# EAGLE design MBHP_CORE_STM32F4v1.1.2 (EAGLE 6.5.0)
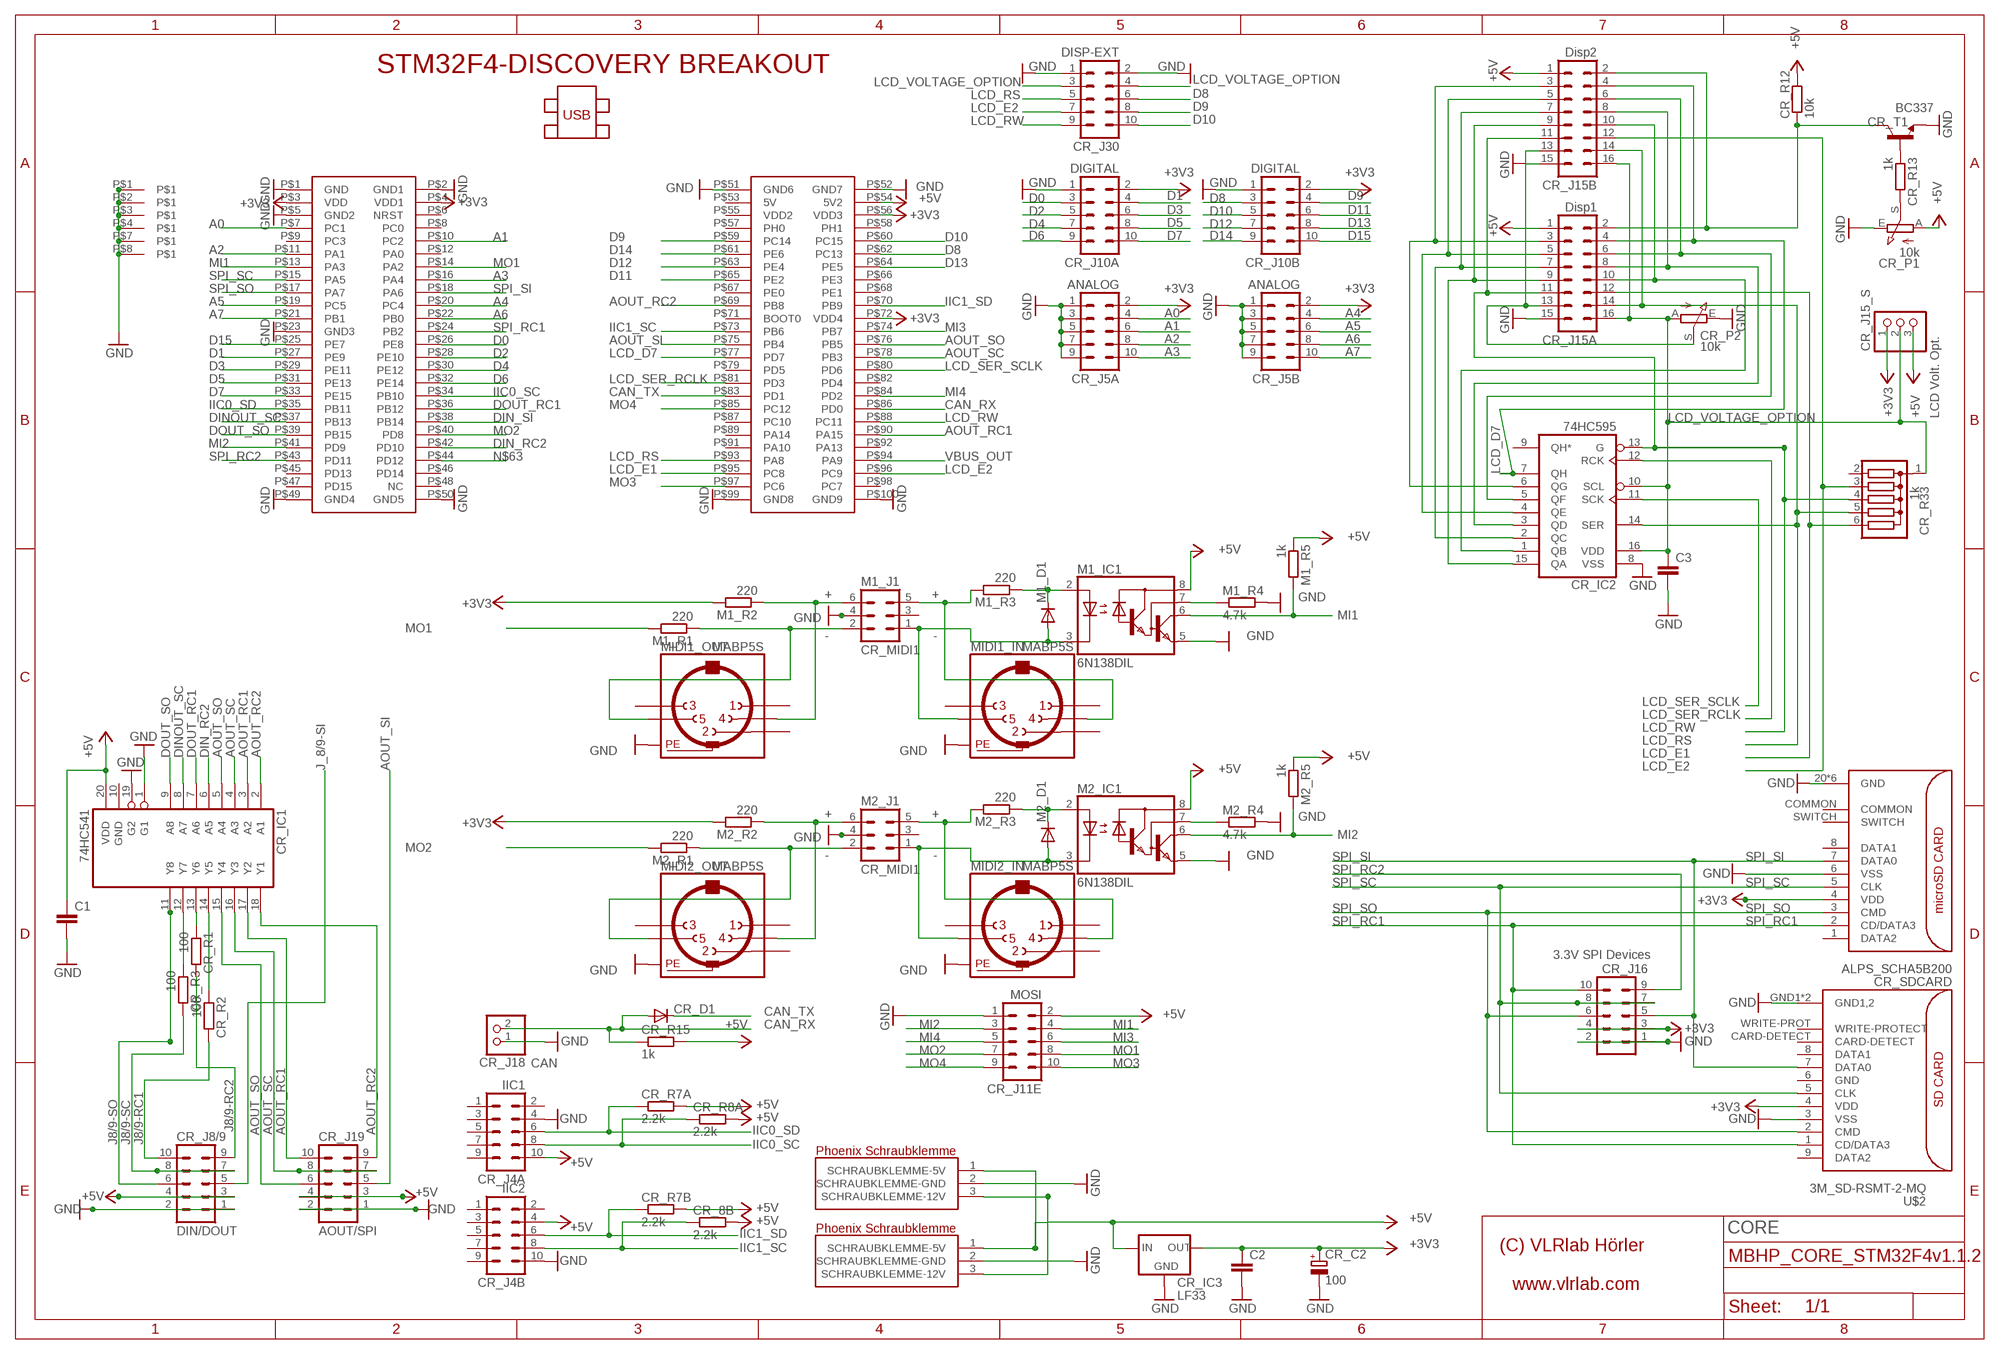
[diagram p0: schematic, sheet 1]

## Parts
C1  C-EU025-025X050  [C025-025X050]
C2  C-EU025-025X050  [C025-025X050]
C3  C-EU025-025X050  [C025-025X050]
CR_8B  2.2k  R-EU_0204/7  [0204/7]
CR_C2  100  CPOL-EUE5-10.5  [E5-10,5]
CR_D1  1N4148  1N4148DO35-7  [DO35-7]
CR_IC1  74HC541  [DIL20]
CR_IC2  74HC595  [DIL16]
CR_IC3  LF33  [TO220]
CR_J4A  IIC1  ML10  [ML10]
CR_J4B  IIC2  ML10  [ML10]
CR_J5A  ANALOG  ML10  [ML10]
CR_J5B  ANALOG  ML10  [ML10]
CR_J8/9  DIN/DOUT  ML10  [ML10]
CR_J10A  DIGITAL  ML10  [ML10]
CR_J10B  DIGITAL  ML10  [ML10]
CR_J11E  MOSI  ML10  [ML10]
CR_J15_S  LCD Volt. Opt.  PINHD-1X3  [1X03]
CR_J15A  Disp1  ML16  [ML16]
CR_J15B  Disp2  ML16  [ML16]
CR_J16  3.3V SPI Devices  ML10  [ML10]
CR_J18  CAN  PINHD-1X2  [1X02]
CR_J19  AOUT/SPI  ML10  [ML10]
CR_J30  DISP-EXT  ML10  [ML10]
CR_P1  10k  PHIER_6MM  [6MM_V]
CR_P2  10k  PHIER_6MM  [6MM_V]
CR_R1  100  R-EU_0204/7  [0204/7]
CR_R2  100  R-EU_0204/7  [0204/7]
CR_R3  100  R-EU_0204/7  [0204/7]
CR_R7A  2.2k  R-EU_0204/7  [0204/7]
CR_R7B  2.2k  R-EU_0204/7  [0204/7]
CR_R8A  2.2k  R-EU_0204/7  [0204/7]
CR_R12  10k  R-EU_0204/7  [0204/7]
CR_R13  1k  R-EU_0204/7  [0204/7]
CR_R15  1k  R-EU_0204/7  [0204/7]
CR_R33  1k  4306R  [SIL6]
CR_SDCARD  ALPS_SCHA5B200  [ALPS_SCHA5B0200_MICRO_SD_PUSHPUSH]
CR_T1  BC337  [TO92]
KLEMME3  PT-1.5/3  [PT-1.5/3-5.0]
KLEMME4  PT-1.5/3  [PT-1.5/3-5.0]
M1_D1  1N4148DO35-7  [DO35-7]
M1_IC1  6N138DIL  [DIL08]
M1_J1  CR_MIDI1  ML6  [ML6]
M1_R1  220  R-EU_0204/7  [0204/7]
M1_R2  220  R-EU_0204/7  [0204/7]
M1_R3  220  R-EU_0204/7  [0204/7]
M1_R4  4.7k  R-EU_0204/7  [0204/7]
M1_R5  1k  R-EU_0204/7  [0204/7]
M2_D1  1N4148DO35-7  [DO35-7]
M2_IC1  6N138DIL  [DIL08]
M2_J1  CR_MIDI1  ML6  [ML6]
M2_R1  220  R-EU_0204/7  [0204/7]
M2_R2  220  R-EU_0204/7  [0204/7]
M2_R3  220  R-EU_0204/7  [0204/7]
M2_R4  4.7k  R-EU_0204/7  [0204/7]
M2_R5  1k  R-EU_0204/7  [0204/7]
MIDI1_IN  MABP5S  [MABP5S]
MIDI1_OUT  MABP5S  [MABP5S]
MIDI2_IN  MABP5S  [MABP5S]
MIDI2_OUT  MABP5S  [MABP5S]
OUTLINE  MIDIBOX_FULL  [MIDIBOX14X12]
STM32F4DISCOVERY  STM32F4-DISCOVERY  [STM32F4-DISCOVERY]
U$2  3M_SD-RSMT-2-MQ  [3M_SD-RSMT-2-MQ]

## Nets
+3V3 [SDcard]: C2.1 CR_C2.+ CR_IC3.OUT CR_J5A.2 CR_J5B.2 CR_J10A.2 CR_J10B.2 CR_J15_S.1 CR_J16.3 CR_J16.4 CR_SDCARD.4(VDD) M1_R2.2 M2_R2.2 STM32F4DISCOVERY.P$3(VDD) STM32F4DISCOVERY.P$4(VDD1) STM32F4DISCOVERY.P$56(VDD3) STM32F4DISCOVERY.P$72(VDD4) U$2.4(VDD)
+5V [VDD]: C1.1 CR_8B.2 CR_IC1.20(VDD) CR_IC3.IN CR_J4A.10 CR_J4B.4 CR_J8/9.3 CR_J8/9.4 CR_J11E.2 CR_J15_S.3 CR_J15A.1 CR_J15B.1 CR_J19.3 CR_J19.4 CR_P1.A CR_R7A.2 CR_R7B.2 CR_R8A.2 CR_R12.2 CR_R15.2 KLEMME3.1(SCHRAUBKLEMME-5V) KLEMME4.1(SCHRAUBKLEMME-5V) M1_IC1.8(VCC) M1_R5.1 M2_IC1.8(VCC) M2_R5.1 STM32F4DISCOVERY.P$54(5V2)
+12V1 [10V]: KLEMME3.3(SCHRAUBKLEMME-12V) KLEMME4.3(SCHRAUBKLEMME-12V)
A0: CR_J5A.4 STM32F4DISCOVERY.P$7(PC1)
A1: CR_J5A.6 STM32F4DISCOVERY.P$10(PC2)
A2: CR_J5A.8 STM32F4DISCOVERY.P$11(PA1)
A3: CR_J5A.10 STM32F4DISCOVERY.P$16(PA4)
A4: CR_J5B.4 STM32F4DISCOVERY.P$20(PC4)
A5: CR_J5B.6 STM32F4DISCOVERY.P$19(PC5)
A6: CR_J5B.8 STM32F4DISCOVERY.P$22(PB0)
A7: CR_J5B.10 STM32F4DISCOVERY.P$21(PB1)
AOUT_RC1: CR_IC1.3(A2) CR_IC1.17(Y2) CR_J19.10 STM32F4DISCOVERY.P$90(PA15)
AOUT_RC2: CR_IC1.2(A1) CR_IC1.18(Y1) CR_J19.9 STM32F4DISCOVERY.P$69(PB8)
AOUT_SC: CR_IC1.4(A3) CR_IC1.16(Y3) CR_J19.7 CR_J19.8 STM32F4DISCOVERY.P$78(PB3)
AOUT_SI: CR_J19.5 STM32F4DISCOVERY.P$75(PB4)
AOUT_SO: CR_IC1.5(A4) CR_IC1.15(Y4) CR_J19.6 STM32F4DISCOVERY.P$76(PB5)
CAN_RX: CR_D1.A CR_J18.2 CR_R15.1 STM32F4DISCOVERY.P$86(PD0)
CAN_TX: CR_D1.C STM32F4DISCOVERY.P$83(PD1)
D0: CR_J10A.3 STM32F4DISCOVERY.P$26(PE8)
D1: CR_J10A.4 STM32F4DISCOVERY.P$27(PE9)
D2: CR_J10A.5 STM32F4DISCOVERY.P$28(PE10)
D3: CR_J10A.6 STM32F4DISCOVERY.P$29(PE11)
D4: CR_J10A.7 STM32F4DISCOVERY.P$30(PE12)
D5: CR_J10A.8 STM32F4DISCOVERY.P$31(PE13)
D6: CR_J10A.9 STM32F4DISCOVERY.P$32(PE14)
D7: CR_J10A.10 STM32F4DISCOVERY.P$33(PE15)
D8: CR_J10B.3 CR_J30.6 STM32F4DISCOVERY.P$62(PC13)
D9: CR_J10B.4 CR_J30.8 STM32F4DISCOVERY.P$59(PC14)
D10: CR_J10B.5 CR_J30.10 STM32F4DISCOVERY.P$60(PC15)
D11: CR_J10B.6 STM32F4DISCOVERY.P$65(PE2)
D12: CR_J10B.7 STM32F4DISCOVERY.P$63(PE4)
D13: CR_J10B.8 STM32F4DISCOVERY.P$64(PE5)
D14: CR_J10B.9 STM32F4DISCOVERY.P$61(PE6)
D15: CR_J10B.10 STM32F4DISCOVERY.P$25(PE7)
DIN_RC2: CR_IC1.6(A5) STM32F4DISCOVERY.P$42(PD10)
DIN_SI: STM32F4DISCOVERY.P$38(PB14)
DINOUT_SC: CR_IC1.8(A7) STM32F4DISCOVERY.P$37(PB13)
DOUT_RC1: CR_IC1.7(A6) STM32F4DISCOVERY.P$36(PB12)
DOUT_SO: CR_IC1.9(A8) STM32F4DISCOVERY.P$39(PB15)
GND: C1.2 C2.2 C3.2 CR_C2.- CR_IC1.1(G1) CR_IC1.19(G2) CR_IC2.8(VSS) CR_IC3.GND CR_J4A.4 CR_J4B.10 CR_J5A.1 CR_J5A.3 CR_J5A.5 CR_J5A.7 CR_J5A.9 CR_J5B.1 CR_J5B.3 CR_J5B.5 CR_J5B.7 CR_J5B.9 CR_J8/9.1 CR_J8/9.2 CR_J10A.1 CR_J10B.1 CR_J11E.1 CR_J15A.15 CR_J15B.15 CR_J16.1 CR_J16.2 CR_J18.1 CR_J19.1 CR_J19.2 CR_J30.1 CR_J30.2 CR_P1.E CR_P2.E CR_SDCARD.6(VSS) CR_SDCARD.20(GND) CR_SDCARD.21(GND) CR_SDCARD.22(GND) CR_SDCARD.23(GND) CR_SDCARD.24(GND) CR_SDCARD.25(GND) CR_T1.1(E) KLEMME3.2(SCHRAUBKLEMME-GND) KLEMME4.2(SCHRAUBKLEMME-GND) M1_IC1.5(GND) M1_J1.4 M1_R4.2 M2_IC1.5(GND) M2_J1.4 M2_R4.2 MIDI1_IN.PE MIDI1_IN.PE@(PE) MIDI1_OUT.PE MIDI1_OUT.PE@(PE) MIDI2_IN.PE MIDI2_IN.PE@(PE) MIDI2_OUT.PE MIDI2_OUT.PE@(PE) OUTLINE.P$1 OUTLINE.P$2 OUTLINE.P$3 OUTLINE.P$4 OUTLINE.P$7 OUTLINE.P$8 STM32F4DISCOVERY.P$1(GND) STM32F4DISCOVERY.P$2(GND1) STM32F4DISCOVERY.P$5(GND2) STM32F4DISCOVERY.P$23(GND3) STM32F4DISCOVERY.P$49(GND4) STM32F4DISCOVERY.P$50(GND5) STM32F4DISCOVERY.P$51(GND6) STM32F4DISCOVERY.P$52(GND7) STM32F4DISCOVERY.P$99(GND8) STM32F4DISCOVERY.P$100(GND9) U$2.3(VSS) U$2.GND1(GND1,2) U$2.GND2(GND1,2)
IIC0_SC: CR_J4A.8 CR_R8A.1 STM32F4DISCOVERY.P$34(PB10)
IIC0_SD: CR_J4A.6 CR_R7A.1 STM32F4DISCOVERY.P$35(PB11)
IIC1_SC: CR_8B.1 CR_J4B.8 STM32F4DISCOVERY.P$73(PB6)
IIC1_SD: CR_J4B.6 CR_R7B.1 STM32F4DISCOVERY.P$70(PB9)
J8/9-RC1: CR_J8/9.10 CR_R2.2
J8/9-RC2: CR_J8/9.9 CR_R1.2
J8/9-SC: CR_J8/9.7 CR_J8/9.8 CR_R3.2
J8/9-SO: CR_IC1.11(Y8) CR_J8/9.6
J_8/9-SI: CR_J8/9.5
LCD_D7: CR_IC2.7(QH) CR_J15A.4 CR_J15B.4 STM32F4DISCOVERY.P$77(PD7)
LCD_E1: CR_J15A.12 CR_R33.6 STM32F4DISCOVERY.P$95(PC8)
LCD_E2: CR_J15B.12 CR_J30.7 CR_R33.3 STM32F4DISCOVERY.P$96(PC9)
LCD_RS: CR_IC2.14(SER) CR_J15A.14 CR_J15B.14 CR_J30.5 CR_R33.5 STM32F4DISCOVERY.P$93(PA8)
LCD_RW: CR_IC2.13(G) CR_J15A.11 CR_J15B.11 CR_J30.9 CR_R33.4 STM32F4DISCOVERY.P$88(PC11)
LCD_SER_RCLK: CR_IC2.12(RCK) STM32F4DISCOVERY.P$81(PD3)
LCD_SER_SCLK: CR_IC2.11(SCK) STM32F4DISCOVERY.P$80(PD6)
LCD_VOLTAGE_OPTION [VDD]: C3.1 CR_IC2.10(SCL) CR_IC2.16(VDD) CR_J15_S.2 CR_J15A.16 CR_J15B.16 CR_J30.3 CR_J30.4 CR_P2.A CR_R33.1
M1_R4: M1_IC1.7(VB) M1_R4.1
M1_RX+: M1_J1.5 M1_R3.2 MIDI1_IN.4
M1_RX+D1: M1_D1.C M1_IC1.2(A) M1_R3.1
M1_RX-: M1_D1.A M1_IC1.3(C) M1_J1.1 MIDI1_IN.5
M1_TX+: M1_J1.6 M1_R2.1 MIDI1_OUT.4
M1_TX-: M1_J1.2 M1_R1.1 MIDI1_OUT.5
M2_R4: M2_IC1.7(VB) M2_R4.1
M2_RX+: M2_J1.5 M2_R3.2 MIDI2_IN.4
M2_RX+D1: M2_D1.C M2_IC1.2(A) M2_R3.1
M2_RX-: M2_D1.A M2_IC1.3(C) M2_J1.1 MIDI2_IN.5
M2_TX+: M2_J1.6 M2_R2.1 MIDI2_OUT.4
M2_TX-: M2_J1.2 M2_R1.1 MIDI2_OUT.5
MI1: CR_J11E.4 M1_IC1.6(VO) M1_R5.2 STM32F4DISCOVERY.P$13(PA3)
MI2: CR_J11E.3 M2_IC1.6(VO) M2_R5.2 STM32F4DISCOVERY.P$41(PD9)
MI3: CR_J11E.6 STM32F4DISCOVERY.P$74(PB7)
MI4: CR_J11E.5 STM32F4DISCOVERY.P$84(PD2)
MO1: CR_J11E.8 M1_R1.2 STM32F4DISCOVERY.P$14(PA2)
MO2: CR_J11E.7 M2_R1.2 STM32F4DISCOVERY.P$40(PD8)
MO3: CR_J11E.10 STM32F4DISCOVERY.P$97(PC6)
MO4: CR_J11E.9 STM32F4DISCOVERY.P$85(PC12)
N$1: CR_IC2.6(QG) CR_J15A.3 CR_J15B.3
N$2: CR_IC2.5(QF) CR_J15A.6 CR_J15B.6
N$3: CR_IC2.4(QE) CR_J15A.5 CR_J15B.5
N$4: CR_IC2.3(QD) CR_J15A.8 CR_J15B.8
N$8: CR_IC2.2(QC) CR_J15A.7 CR_J15B.7
N$9: CR_IC2.1(QB) CR_J15A.10 CR_J15B.10
N$10: CR_IC2.15(QA) CR_J15A.9 CR_J15B.9
N$12: CR_J15A.13 CR_J15B.13 CR_P2.S
N$14: CR_P1.S CR_R13.2
N$15: CR_R13.1 CR_T1.2(B)
N$16: M2_J1.3
N$18: CR_J15A.2 CR_J15B.2 CR_R12.1 CR_T1.3(C)
N$24: M1_J1.3
N$63: STM32F4DISCOVERY.P$44(PD12)
RC-I-: CR_IC1.14(Y5) CR_R2.1
RC-O-: CR_IC1.13(Y6) CR_R1.1
SC-: CR_IC1.12(Y7) CR_R3.1
SPI_RC1: CR_J16.10 CR_SDCARD.2(CD/DATA3) STM32F4DISCOVERY.P$24(PB2) U$2.1(CD/DATA3)
SPI_RC2: CR_J16.9 STM32F4DISCOVERY.P$43(PD11)
SPI_SC: CR_J16.7 CR_J16.8 CR_SDCARD.5(CLK) STM32F4DISCOVERY.P$15(PA5) U$2.5(CLK)
SPI_SI: CR_J16.5 CR_SDCARD.7(DATA0) STM32F4DISCOVERY.P$18(PA6) U$2.7(DATA0)
SPI_SO: CR_J16.6 CR_SDCARD.3(CMD) STM32F4DISCOVERY.P$17(PA7) U$2.2(CMD)
VBUS_OUT: STM32F4DISCOVERY.P$94(PA9)
Unconnected: CR_IC2.9(QH*) CR_J4A.1 CR_J4A.2 CR_J4A.3 CR_J4A.5 CR_J4A.7 CR_J4A.9 CR_J4B.1 CR_J4B.2 CR_J4B.3 CR_J4B.5 CR_J4B.7 CR_J4B.9 CR_R33.2 CR_SDCARD.1(DATA2) CR_SDCARD.8(DATA1) CR_SDCARD.COMMON CR_SDCARD.SWITCH MIDI1_IN.1 MIDI1_IN.2 MIDI1_IN.3 MIDI1_OUT.1 MIDI1_OUT.2 MIDI1_OUT.3 MIDI2_IN.1 MIDI2_IN.2 MIDI2_IN.3 MIDI2_OUT.1 MIDI2_OUT.2 MIDI2_OUT.3 STM32F4DISCOVERY.P$6(NRST) STM32F4DISCOVERY.P$8(PC0) STM32F4DISCOVERY.P$9(PC3) STM32F4DISCOVERY.P$12(PA0) STM32F4DISCOVERY.P$45(PD13) STM32F4DISCOVERY.P$46(PD14) STM32F4DISCOVERY.P$47(PD15) STM32F4DISCOVERY.P$48(NC) STM32F4DISCOVERY.P$53(5V) STM32F4DISCOVERY.P$55(VDD2) STM32F4DISCOVERY.P$57(PH0) STM32F4DISCOVERY.P$58(PH1) STM32F4DISCOVERY.P$66(PE3) STM32F4DISCOVERY.P$67(PE0) STM32F4DISCOVERY.P$68(PE1) STM32F4DISCOVERY.P$71(BOOT0) STM32F4DISCOVERY.P$79(PD5) STM32F4DISCOVERY.P$82(PD4) STM32F4DISCOVERY.P$87(PC10) STM32F4DISCOVERY.P$89(PA14) STM32F4DISCOVERY.P$91(PA10) STM32F4DISCOVERY.P$92(PA13) STM32F4DISCOVERY.P$98(PC7) U$2.6(GND) U$2.8(DATA1) U$2.9(DATA2) U$2.CARD-DETECT U$2.WRITE-PROT(WRITE-PROTECT)

## Notes on the sheet
- + | +
- - | -
- + | +
- - | -
- CORE

## Power pins joined to a net without a drawn wire
GND: CR_IC1.10(GND)

## Library data of the parts
C1-C3 = rcl:C-EU: CAPACITOR, European symbol
CR_8B CR_R1-CR_R3 CR_R7A CR_R7B CR_R8A = rcl:R-EU_: RESISTOR, European symbol
CR_C2 = rcl:CPOL-EU: POLARIZED CAPACITOR, European symbol
CR_D1 M1_D1 M2_D1 = diode:1N4148: DIODE high speed (Philips)
CR_IC1 = 595-541-165-uln2803:74HC541
CR_IC2 = 74-595:74HC595
CR_IC3 = LF33:LF33
CR_J4A CR_J4B CR_J5A CR_J5B CR_J8/9 CR_J10A CR_J10B CR_J11E CR_J16 CR_J19 CR_J30 = con-harting-ml:ML10: HARTING; OC_FARNELL: unknown; OC_NEWARK: unknown
CR_J15_S = pinhead_Ivan:PINHD-1X3: PIN HEADER
CR_J15A CR_J15B = con-ml:ML16: HARTING; OC_FARNELL: unknown; OC_NEWARK: unknown
CR_J18 = pinhead_Ivan:PINHD-1X2: PIN HEADER
CR_P1 CR_P2 = Potentiometer 6mm:PHIER_6MM
CR_R12 CR_R13 CR_R15 M1_R1-M1_R5 M2_R1-M2_R5 = resistor:R-EU_: RESISTOR, European symbol
CR_R33 = Bourns Resistor Array:4306R
CR_SDCARD = Micro SD:ALPS_SCHA5B200
CR_T1 = transistor:BC337: NPN TRANSISTOR
KLEMME3 KLEMME4 = Phonenix Contacts:PT-1.5/3
M1_IC1 M2_IC1 = 6N138:6N138DIL
M1_J1 M2_J1 = con-harting-ml:ML6: HARTING; OC_FARNELL: unknown; OC_NEWARK: unknown
MIDI1_IN MIDI1_OUT MIDI2_IN MIDI2_OUT = midi:MABP5S
OUTLINE = Frames_VLR:MIDIBOX_FULL
STM32F4DISCOVERY = STM32F4-DISCOVERY:STM32F4-DISCOVERY
U$2 = Memory:3M_SD-RSMT-2-MQ

## Net classes
0 default: width 0.254 mm, drill 0.33 mm, clearance 0.254 mm
1 VDD: width 1.016 mm, drill 0.33 mm, clearance 0.254 mm to class 0, clearance 0.254 mm
2 10V: width 1.016 mm, drill 0.33 mm, clearance 0.254 mm to class 0, clearance 0.254 mm to class 1, clearance 0.254 mm
3 SDcard: width 0.406 mm

## Board
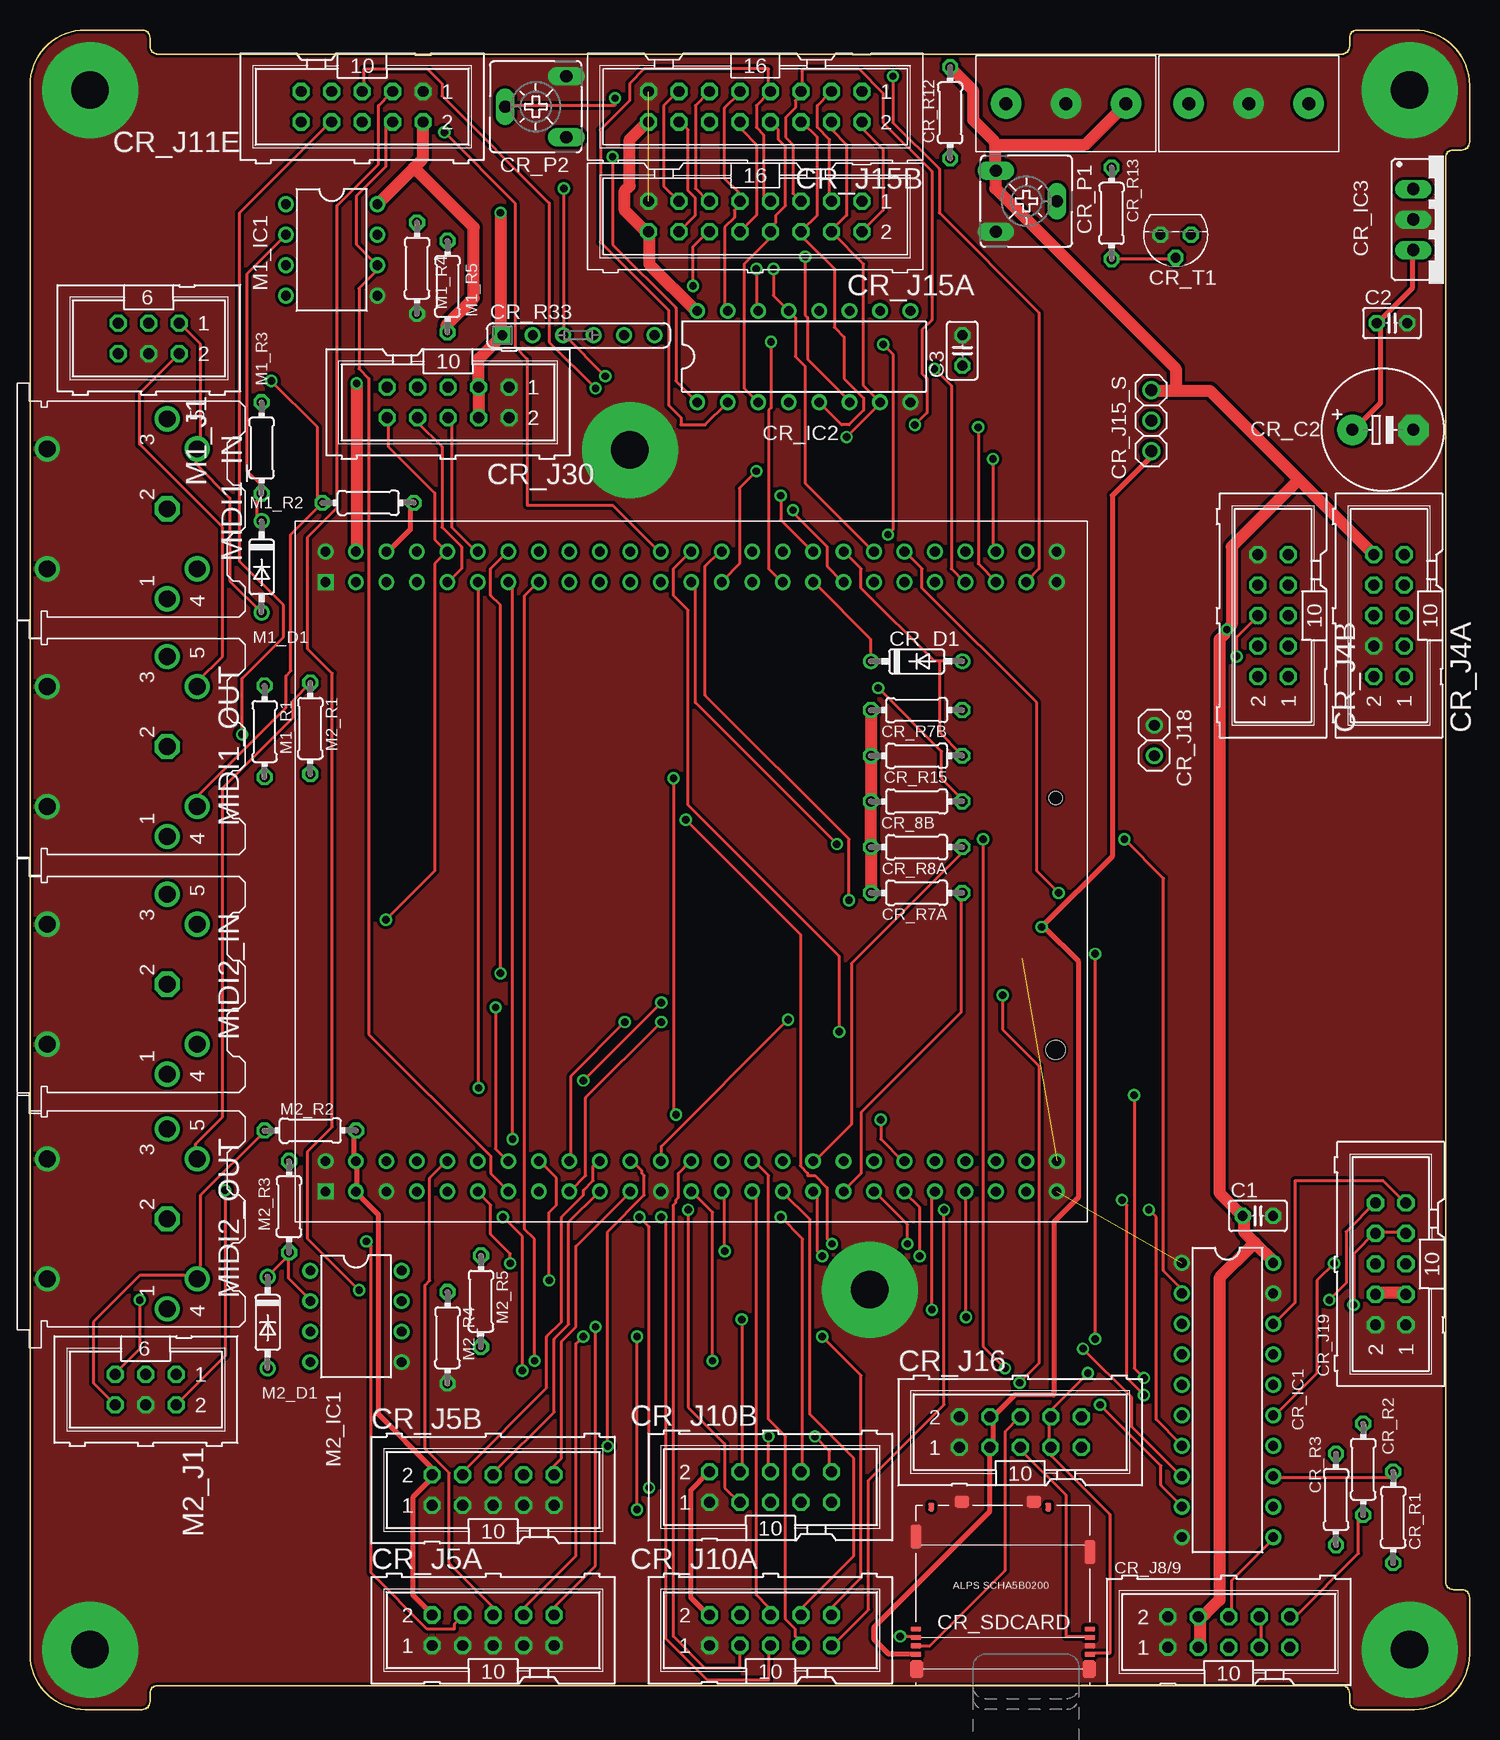
[diagram p1: board, top side]
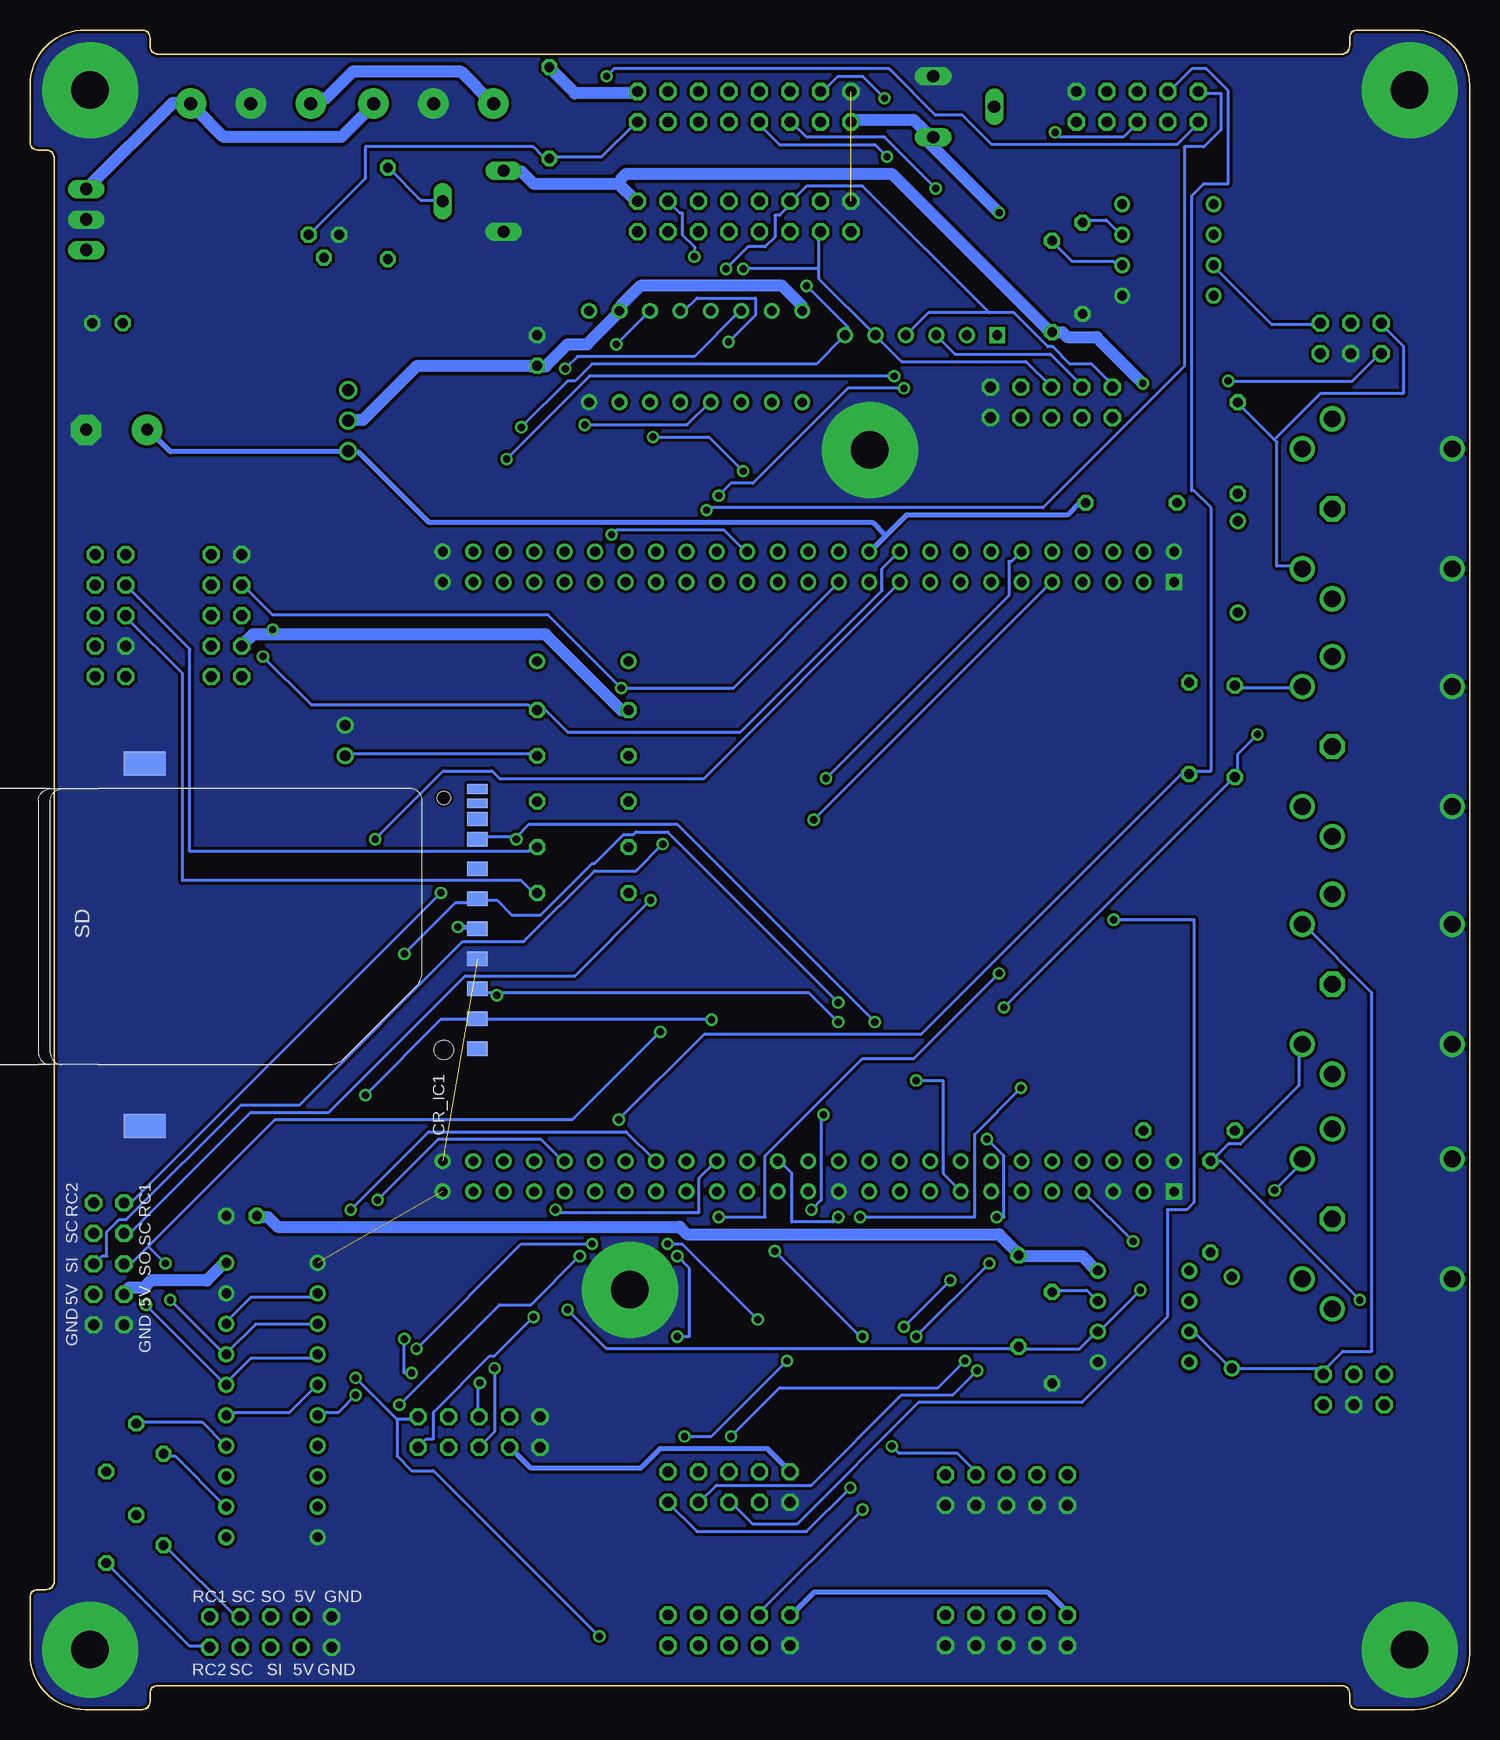
[diagram p2: board, bottom side, seen from below]

Size 120 x 140 mm. Coordinates in mm from the lower left corner, seen from the top.
Copper layers (1*16): Top 0.035mm / dielectric 1.5mm / Bottom 0.035mm
Design rules "makePCB *": minimum track width 10mil, minimum drill 24mil, track to track 8mil, track to pad 8mil, pad to pad 8mil, via to via 8mil, smd to smd 8mil, copper to edge 8mil, drill to drill 8mil, minimum pad ring 10mil, minimum via ring 8mil, stop-mask expansion 4mil, vias tented up to drill 0mil, thermal gap 0mil

### Footprints (pad centres in the part's own frame; a part is rotated, then mirrored left to right if it is on the bottom)
C025-025X050 = drill 0.813 octagon: 1 -1.27,0; 2 1.27,0
0204/7 = drill 0.813 octagon: 1 -3.81,0; 2 3.81,0
E5-10,5 = drill 1.016 pad 2.54: + -2.54,0 | drill 1.016 pad 2.54 octagon: - 2.54,0
DO35-7 = drill 0.813: A 3.81,0; C -3.81,0
DIL20 = drill 0.813: 1 -11.43,-3.81; 2 -8.89,-3.81; 3 -6.35,-3.81; 4 -3.81,-3.81; 5 -1.27,-3.81; 6 1.27,-3.81; 7 3.81,-3.81; 8 6.35,-3.81; 9 8.89,-3.81; 10 11.43,-3.81; 11 11.43,3.81; 12 8.89,3.81; 13 6.35,3.81; 14 3.81,3.81; 15 1.27,3.81; 16 -1.27,3.81; 17 -3.81,3.81; 18 -6.35,3.81; 19 -8.89,3.81; 20 -11.43,3.81
DIL16 = drill 0.813: 1 -8.89,-3.81; 2 -6.35,-3.81; 3 -3.81,-3.81; 4 -1.27,-3.81; 5 1.27,-3.81; 6 3.81,-3.81; 7 6.35,-3.81; 8 8.89,-3.81; 9 8.89,3.81; 10 6.35,3.81; 11 3.81,3.81; 12 1.27,3.81; 13 -1.27,3.81; 14 -3.81,3.81; 15 -6.35,3.81; 16 -8.89,3.81
TO220 = drill 1.016 long: GND 0,0; IN -2.54,0; OUT 2.54,0
ML10 = drill 0.914 octagon: 1 -5.08,-1.27; 2 -5.08,1.27; 3 -2.54,-1.27; 4 -2.54,1.27; 5 0,-1.27; 6 0,1.27; 7 2.54,-1.27; 8 2.54,1.27; 9 5.08,-1.27; 10 5.08,1.27
1X03 = drill 1.016: 1 -2.54,0; 2 0,0; 3 2.54,0
ML16 = drill 0.914 octagon: 1 -8.89,-1.27; 2 -8.89,1.27; 3 -6.35,-1.27; 4 -6.35,1.27; 5 -3.81,-1.27; 6 -3.81,1.27; 7 -1.27,-1.27; 8 -1.27,1.27; 9 1.27,-1.27; 10 1.27,1.27; 11 3.81,-1.27; 12 3.81,1.27; 13 6.35,-1.27; 14 6.35,1.27; 15 8.89,-1.27; 16 8.89,1.27
1X02 = drill 0.9: 1 -1.27,0; 2 1.27,0
6MM_V = drill 1.016 long: A -2.54,-2.54; E 2.54,-2.54; S 0,2.54
SIL6 = drill 0.813 square: 1 -6.35,0 | drill 0.813: 2 -3.81,0; 3 -1.27,0; 4 1.27,0; 5 3.81,0; 6 6.35,0
ALPS_SCHA5B0200_MICRO_SD_PUSHPUSH = smd 0.9 x 0.45: 1 -0.062,4.675; 2 -0.062,3.975; 3 -0.062,3.275; 4 -0.062,2.575; 5 14.438,2.575; 6 14.438,3.275; 7 14.438,3.975; 8 14.438,4.675 | smd 1.1 x 1.5: 20 0,1.35; 21 14.375,1.35 | smd 0.9 x 2: 22 -0.062,12.4; 23 14.438,11.1 | smd 1.2 x 1: 24 3.763,15.3; 25 9.762,15.3 | smd 0.5 x 0.7: COMMON 1.212,14.85; SWITCH 10.963,14.85
TO92 = drill 0.813 octagon: 1 1.27,0; 2 0,1.905; 3 -1.27,0
PT-1.5/3-5.0 = drill 1.1 pad 2.54: 1 5,0; 2 0,0; 3 -5,0
DIL08 = drill 0.813: 1 -3.81,-3.81; 2 -1.27,-3.81; 3 1.27,-3.81; 4 3.81,-3.81; 5 3.81,3.81; 6 1.27,3.81; 7 -1.27,3.81; 8 -3.81,3.81
ML6 = drill 0.914 octagon: 1 -2.54,-1.27; 2 -2.54,1.27; 3 0,-1.27; 4 0,1.27; 5 2.54,-1.27; 6 2.54,1.27
MABP5S = drill 1.4: 1 -7.5,0; 3 7.5,0; 4 -5,-2.5; 5 5,-2.5; PE 5,10; PE@ -5,10 | drill 1.4 octagon: 2 0,0
MIDIBOX14X12 = drill 3.1 pad 8: P$1 5,135; P$2 50,105; P$3 70,35; P$4 5,5; P$7 115,135; P$8 115,5
STM32F4-DISCOVERY = drill 0.8 square: P$1 -27.94,30.48; P$51 22.86,30.48 | drill 0.8: P$2 -25.4,30.48; P$3 -27.94,27.94; P$4 -25.4,27.94; P$5 -27.94,25.4; P$6 -25.4,25.4; P$7 -27.94,22.86; P$8 -25.4,22.86; P$9 -27.94,20.32; P$10 -25.4,20.32; P$11 -27.94,17.78; P$12 -25.4,17.78; P$13 -27.94,15.24; P$14 -25.4,15.24; P$15 -27.94,12.7; P$16 -25.4,12.7; P$17 -27.94,10.16; P$18 -25.4,10.16; P$19 -27.94,7.62; P$20 -25.4,7.62; P$21 -27.94,5.08; P$22 -25.4,5.08; P$23 -27.94,2.54; P$24 -25.4,2.54; P$25 -27.94,0; P$26 -25.4,0; P$27 -27.94,-2.54; P$28 -25.4,-2.54; P$29 -27.94,-5.08; P$30 -25.4,-5.08; P$31 -27.94,-7.62; P$32 -25.4,-7.62; P$33 -27.94,-10.16; P$34 -25.4,-10.16; P$35 -27.94,-12.7; P$36 -25.4,-12.7; P$37 -27.94,-15.24; P$38 -25.4,-15.24; P$39 -27.94,-17.78; P$40 -25.4,-17.78; P$41 -27.94,-20.32; P$42 -25.4,-20.32; P$43 -27.94,-22.86; P$44 -25.4,-22.86; P$45 -27.94,-25.4; P$46 -25.4,-25.4; P$47 -27.94,-27.94; P$48 -25.4,-27.94; P$49 -27.94,-30.48; P$50 -25.4,-30.48; P$52 25.4,30.48; P$53 22.86,27.94; P$54 25.4,27.94; P$55 22.86,25.4; P$56 25.4,25.4; P$57 22.86,22.86; P$58 25.4,22.86; P$59 22.86,20.32; P$60 25.4,20.32; P$61 22.86,17.78; P$62 25.4,17.78; P$63 22.86,15.24; P$64 25.4,15.24; P$65 22.86,12.7; P$66 25.4,12.7; P$67 22.86,10.16; P$68 25.4,10.16; P$69 22.86,7.62; P$70 25.4,7.62; P$71 22.86,5.08; P$72 25.4,5.08; P$73 22.86,2.54; P$74 25.4,2.54; P$75 22.86,0; P$76 25.4,0; P$77 22.86,-2.54; P$78 25.4,-2.54; P$79 22.86,-5.08; P$80 25.4,-5.08; P$81 22.86,-7.62; P$82 25.4,-7.62; P$83 22.86,-10.16; P$84 25.4,-10.16; P$85 22.86,-12.7; P$86 25.4,-12.7; P$87 22.86,-15.24; P$88 25.4,-15.24; P$89 22.86,-17.78; P$90 25.4,-17.78; P$91 22.86,-20.32; P$92 25.4,-20.32; P$93 22.86,-22.86; P$94 25.4,-22.86; P$95 22.86,-25.4; P$96 25.4,-25.4; P$97 22.86,-27.94; P$98 25.4,-27.94; P$99 22.86,-30.48; P$100 25.4,-30.48
3M_SD-RSMT-2-MQ = smd 1.2 x 1.7: 1 22.16,31.6; 2 19.66,31.6; 3 17.16,31.6; 4 14.66,31.6; 5 12.16,31.6; 6 9.66,31.6; 7 7.23,31.6; 8 5.53,31.6; 9 24.66,31.6 | smd 0.8 x 1.7: CARD-DETECT 4.23,31.6; WRITE-PROT 3.03,31.6 | smd 2 x 3.5: GND1 0.9,3.85; GND2 31.1,3.85 | hole 1.6: 24.78,28.8 | hole 1.1: 3.78,28.8

### Placement (x,y rotation side)
C1  102.36,41.15 0 top
C2  113.54,115.57 0 top
C3  77.72,113.28 90 top
CR_8B  73.91,75.69 180 top
CR_C2  112.78,106.68 0 top
CR_D1  73.91,87.38 0 top
CR_IC1  99.82,25.8 270 top
CR_IC2  64.52,112.78 0 top
CR_IC3  115.32,124.21 270 top
CR_J4A  113.28,91.19 90 top
CR_J4B  103.63,91.19 90 top
CR_J5A  38.61,6.6 0 top
CR_J5B  38.61,18.29 0 top
CR_J8/9  99.92,6.45 0 top
CR_J10A  61.72,6.6 0 top
CR_J10B  61.72,18.54 0 top
CR_J11E  27.69,133.6 180 top
CR_J15_S  93.47,107.44 90 top
CR_J15A  60.45,124.46 180 top
CR_J15B  60.45,133.6 180 top
CR_J16  82.55,23.11 0 top
CR_J18  93.73,80.77 270 top
CR_J19  113.44,37.13 90 top
CR_J30  34.85,108.97 180 top
CR_P1  83.06,125.73 270 top
CR_P2  42.16,133.6 90 top
CR_R1  113.64,16.02 270 top
CR_R2  111.14,20.02 270 top
CR_R3  108.87,17.51 270 top
CR_R7A  73.91,68.07 180 top
CR_R7B  73.91,83.31 180 top
CR_R8A  73.91,71.88 180 top
CR_R12  76.71,133.1 90 top
CR_R13  90.17,124.71 90 top
CR_R15  73.91,79.5 180 top
CR_R33  45.72,114.55 0 top
CR_SDCARD  73.91,2.03 0 top
CR_T1  95.5,122.94 180 top
KLEMME3  101.6,133.86 0 top
KLEMME4  86.36,133.86 0 top
M1_D1  19.3,95.25 270 top
M1_IC1  25.15,121.67 270 top
M1_J1  9.91,114.3 180 top
M1_R1  19.56,81.53 270 top
M1_R2  28.19,100.58 0 top
M1_R3  19.3,105.16 90 top
M1_R4  32.26,120.14 270 top
M1_R5  34.8,118.62 90 top
M2_D1  19.81,32.26 270 top
M2_IC1  27.18,32.77 270 top
M2_J1  9.65,26.67 180 top
M2_R1  23.37,81.79 270 top
M2_R2  23.37,48.26 0 top
M2_R3  21.59,41.91 90 top
M2_R4  34.8,30.99 270 top
M2_R5  37.59,34.04 270 top
MIDI1_IN  11.43,100.08 90 top
MIDI1_OUT  11.43,80.26 90 top
MIDI2_IN  11.43,60.45 90 top
MIDI2_OUT  11.43,40.89 90 top
OUTLINE  0,0 0 top
STM32F4DISCOVERY  55.12,71.12 90 top
U$1  [CORE_LPC17]  213.82,-2.54 270 bottom  (outside the outline)
U$2  114.3,79.76 270 bottom
U$5  [CORE_LPC17]  167.89,22.05 0 top  (outside the outline)
U$6  [VLRLAB]  33.32,8.53 0 bottom
U$7  [VLRLAB]  9.14,8.53 0 top

### Tracks (layer width: path | path; a pad name or v marks a point on that pad's centre or on a via)
+3V3  (via drill 0.61)
  Top 0.406: CR_J10A.2 56.49,7.92 55.07,9.35 55.07,18.29 56.49,19.71 CR_J10B.2 | M2_R2.2 27.03,48.16 27.03,45.72 STM32F4DISCOVERY.P$4 27.23,45.72 27.23,43.28 STM32F4DISCOVERY.P$3 27.23,43.08 29.06,41.25 29.06,24.59 33.53,20.12 33.53,19.71 CR_J5B.2 33.53,19.51 33.53,19.3 31.9,17.68 31.9,9.55 33.53,7.92 CR_J5A.2 | CR_IC3.OUT 115.21,121.51 115.21,118.47 112.37,115.62 C2.1 112.57,115.62 112.57,108.92 110.34,106.68 CR_C2.+ | STM32F4DISCOVERY.P$56 29.87,96.52 31.7,98.35 31.7,99.97 31.9,100.18 31.9,100.58 M1_R2.2 | CR_J15_S.1 93.47,104.85 93.47,104.44 90.22,101.19 90.22,71.12 v84.33,65.23 84.53,65.23 87.38,62.38 87.38,42.67 85.34,40.64 85.34,26.21 82.09,26.21 80.26,24.38 CR_J16.4 80.06,24.38 80.26,24.18 80.26,22.15 80.06,21.95 CR_J16.3 80.01,16.51 70.36,6.86 70.36,5.84 71.59,4.61 CR_SDCARD.4
  Bottom 0.406: CR_J16.3 79.86,21.74 78.23,20.12 69.09,20.12 67.46,21.74 58.52,21.74 56.69,19.91 CR_J10B.2 | CR_J10A.2 56.49,7.92 54.66,9.75 35.15,9.75 33.53,8.13 33.53,7.92 CR_J5A.2 | 48.67,97.84 46.94,99.57 33.53,99.57 32.51,100.58 32.11,100.58 M1_R2.2 | 48.67,97.84 49.99,96.52 STM32F4DISCOVERY.P$72 | v84.33,65.23 82.7,65.23 U$2.4 | 93.47,104.85 92.66,104.85 86.77,98.96 49.78,98.96 48.77,97.94 48.67,97.84 | 93.47,104.85 CR_J15_S.1 93.47,104.85 | 93.47,104.85 108.31,104.85 110.13,106.68 CR_C2.+
+5V  (via drill 0.61)
  Top 1.016: CR_J19.4 112.17,34.75 114.61,34.75 CR_J19.3 | CR_J8/9.3 97.54,5.28 97.54,7.72 CR_J8/9.4 97.94,7.92 99.16,9.14 99.16,35.97 101.8,38.61 102.11,38.91 | 102.11,38.91 101.19,39.83 101.19,41.05 C1.1 100.79,41.45 99.16,43.08 99.16,89.2 99.57,89.61 v99.77,90.02 100.18,90.42 100.18,96.93 105.46,102.21 105.77,102.51 | 102.11,38.91 103.63,37.39 CR_IC1.20 | CR_R7A.2 70.1,71.73 CR_R8A.2 70.1,72.34 70.1,75.59 CR_8B.2 70.1,76 70.1,79.05 CR_R15.2 70.1,79.65 CR_R7B.2 | 32,128.52 32.72,129.24 32.72,132.28 CR_J11E.2 | 32,128.52 29.06,125.58 M1_IC1.8 | v27.23,110.54 27.23,96.52 STM32F4DISCOVERY.P$54 | 32,128.52 32.31,128.22 36.98,123.55 36.98,117.65 34.75,115.42 34.75,114.81 M1_R5.1 | 105.77,102.51 98.35,109.93 95.5,109.93 | 105.77,102.51 111.96,96.32 CR_J4A.10 | 95.5,109.93 93.47,109.93 CR_J15_S.3 | 80.47,130.45 87.99,130.45 91.24,133.71 KLEMME4.1 | 80.47,130.45 80.47,128.42 CR_P1.A 80.47,127.81 80.47,126.8 95.5,111.76 95.5,110.34 95.5,109.93 | CR_R12.2 76.81,136.75 78.64,134.93 78.64,132.49 80.26,130.86 80.47,130.45
  Bottom 1.016: M2_IC1.8 31.09,36.58 32.31,37.8 37.59,37.8 M2_R5.1 37.8,38.2 39.22,39.62 65.23,39.62 65.84,40.23 99.36,40.23 100.18,41.05 100.99,41.05 C1.1 | CR_J19.4 112.17,34.75 111.76,35.15 110.54,35.15 109.93,35.76 105.26,35.76 103.83,37.19 CR_IC1.20 | 99.77,89.61 77.01,89.61 70.71,83.31 CR_R7B.2 | 99.77,89.61 101.4,89.61 102.21,88.8 CR_J4B.4 | v27.23,110.54 31.09,114.4 33.53,114.4 33.93,114.81 34.75,114.81 M1_R5.1 35.15,115.01 48.16,128.02 70.31,128.02 70.71,127.61 70.92,127.2 | CR_IC3.IN 115.21,126.8 108.1,133.91 106.68,133.91 KLEMME3.1 106.27,133.5 103.83,131.06 94.08,131.06 91.44,133.71 KLEMME4.1 | CR_R12.2 76.61,136.75 74.57,134.72 69.49,134.72 CR_J15B.1 | 70.92,127.2 69.49,125.78 CR_J15A.1 | 70.92,127.2 78.03,127.2 79.05,128.22 80.47,128.22 CR_P1.A | v99.77,90.02 99.77,89.61
+12V1
  Bottom 1.016: KLEMME4.3 81.48,133.91 84.12,136.55 93.07,136.55 95.3,134.31 95.71,134.31 96.11,133.91 96.52,133.91 KLEMME3.3
A0  (via drill 0.61)
  Top 0.254: v28.04,39.01 28.45,38.61 28.45,11.38 33.12,6.71 35.36,6.71 35.36,7.11 35.97,7.72 CR_J5A.4
  Bottom 0.254: v28.04,39.01 32.11,43.08 STM32F4DISCOVERY.P$7
A1
  Top 0.254: STM32F4DISCOVERY.P$10 34.75,45.72 33.33,44.3 33.33,35.76 32.92,35.36 32.92,21.74 34.95,19.71 34.95,12.19 38.61,8.53 38.61,7.92 CR_J5A.6
A2  (via drill 0.61)
  Top 0.254: v40.03,37.19 40.03,38 38.41,39.62 38.41,42.06 37.39,43.08 STM32F4DISCOVERY.P$11 | v46.13,31.09 45.52,30.48 45.52,12.8 41.25,8.53 41.25,7.92 CR_J5A.8
  Bottom 0.254: v46.13,31.09 v40.03,37.19
A3  (via drill 0.61)
  Top 0.254: v43.28,35.76 43.28,41.45 43.89,42.06 43.89,44.3 42.47,45.72 STM32F4DISCOVERY.P$16 | v47.14,31.9 47.14,11.99 43.69,8.53 43.69,7.92 CR_J5A.10
  Bottom 0.254: v47.14,31.9 v43.28,35.76
A4
  Top 0.254: STM32F4DISCOVERY.P$20 47.35,45.72 46.94,45.31 46.94,44.09 46.13,43.28 46.13,42.88 44.3,41.05 44.3,32.31 43.08,31.09 43.08,26.82 36.17,19.91 36.17,19.71 CR_J5B.4
A5
  Top 0.254: STM32F4DISCOVERY.P$19 47.35,43.08 44.91,40.64 44.91,32.11 43.69,30.89 43.69,24.79 38.61,19.71 CR_J5B.6
A6  (via drill 0.61)
  Top 0.254: v48.16,21.95 48.16,39.83 51.21,42.88 51.21,44.5 51,44.7 51,44.91 50.19,45.72 STM32F4DISCOVERY.P$22
  Bottom 0.254: v48.16,21.95 47.55,21.34 42.67,21.34 41.05,19.71 CR_J5B.8
A7
  Top 0.254: STM32F4DISCOVERY.P$21 49.99,43.08 45.52,38.61 45.52,31.9 44.3,30.68 44.3,20.93 43.69,20.32 43.69,19.71 CR_J5B.10
AOUT_RC1  (via drill 0.61)
  Top 0.254: v85.75,68.07 83.92,69.9 83.92,83.92 74.37,93.47 74.37,95.1 72.95,96.52 STM32F4DISCOVERY.P$90 | v108.31,34.14 109.73,35.56 109.73,39.83 112.17,42.27 CR_J19.10
  Bottom 0.254: CR_IC1.3 96.11,32.11 101.19,32.11 103.63,29.67 CR_IC1.17 103.83,29.67 v108.31,34.14 | v85.75,68.07 111.56,42.27 112.17,42.27 CR_J19.10
AOUT_RC2  (via drill 0.61)
  Top 0.254: v91.24,72.54 94.49,69.29 94.49,36.58 95.91,35.15 95.91,34.75 CR_IC1.2 | CR_J19.9 114.61,42.27 112.78,44.09 105.46,44.09 105.46,33.93 103.83,32.31 CR_IC1.18
  Bottom 0.254: v91.24,72.54 85.55,78.23 81.48,78.23 80.87,77.62 63.8,77.62 47.55,93.88 STM32F4DISCOVERY.P$69 | CR_IC1.18 103.63,32.31 101.6,34.34 96.32,34.34 96.11,34.54 CR_IC1.2
AOUT_SC  (via drill 0.61)
  Top 0.254: v68.28,67.46 68.28,72.54 56.29,84.53 56.29,95.3 57.51,96.52 STM32F4DISCOVERY.P$78 | 112.17,39.83 114.61,39.83 CR_J19.7 | 112.17,39.83 CR_J19.8 112.17,39.83 | v110.34,33.73 110.34,38 112.17,39.83
  Bottom 0.254: CR_IC1.4 96.11,29.46 96.32,29.26 101.6,29.26 103.63,27.23 CR_IC1.16 103.83,27.23 v110.34,33.73 | v68.28,67.46 74.57,61.16 83.72,61.16 95.1,49.78 101.6,49.78 111.56,39.83 112.17,39.83 CR_J19.8
AOUT_SI  (via drill 0.61)
  Top 0.254: v67.26,72.14 55.47,83.92 55.47,93.67 55.27,93.88 STM32F4DISCOVERY.P$75
  Bottom 0.254: v67.26,72.14 69.49,69.9 72.95,69.9 78.84,64.01 83.92,64.01 97.54,50.39 102.41,50.39 111.96,40.84 112.57,40.84 113.59,39.83 113.59,37.8 114,37.8 114.61,37.19 CR_J19.5
AOUT_SO  (via drill 0.61)
  Top 0.254: v67.46,56.49 67.46,62.79 54.86,75.39 54.86,91.64 53.65,92.86 53.65,95.1 55.07,96.52 STM32F4DISCOVERY.P$76 | v108.71,37.19 107.29,35.76 107.29,28.04 103.83,24.59 CR_IC1.15
  Bottom 0.254: CR_IC1.5 96.11,27.03 98.35,24.79 103.43,24.79 103.63,24.59 CR_IC1.15 | v67.46,56.49 74.78,49.17 99.57,49.17 110.13,38.61 | 110.13,38.61 111.56,37.19 112.17,37.19 CR_J19.6 | 110.13,38.61 v108.71,37.19
CAN_RX
  Top 0.254: 75.79,87.38 77.62,87.38 CR_D1.A | 75.79,87.38 75.39,87.38 69.29,93.47 69.29,95.1 67.87,96.52 STM32F4DISCOVERY.P$86 | 75.79,87.38 75.79,81.48 77.62,79.65 CR_R15.1
  Bottom 0.254: CR_J18.2 93.67,79.65 77.83,79.65 CR_R15.1
CAN_TX
  Top 0.254: CR_D1.C 70.1,89.2 65.43,93.88 STM32F4DISCOVERY.P$83
D0
  Top 0.254: STM32F4DISCOVERY.P$26 55.07,45.72 54.05,44.7 54.05,42.67 53.85,42.47 53.85,42.27 53.65,42.06 53.65,6.1 56.29,3.45 59.13,3.45 59.13,5.28 CR_J10A.3
D1  (via drill 0.61)
  Top 0.254: v57.91,38.2 57.91,42.88 57.71,43.08 STM32F4DISCOVERY.P$27 | v50.6,16.66 v50.6,31.09
  Bottom 0.254: v57.91,38.2 50.8,31.09 v50.6,31.09 | v50.6,16.66 59.33,7.92 CR_J10A.4
D2  (via drill 0.61)
  Top 0.254: v52.63,41.05 53.03,40.64 53.03,5.89 56.49,2.44 61.57,2.44 61.57,5.28 CR_J10A.5
  Bottom 0.254: v52.63,41.05 53.03,40.64 56.49,40.64 56.49,44.7 57.51,45.72 STM32F4DISCOVERY.P$28
D3
  Top 0.254: STM32F4DISCOVERY.P$29 60.35,43.08 60.55,42.88 60.55,9.55 61.57,8.53 61.57,7.92 CR_J10A.6
D4
  Top 0.254: STM32F4DISCOVERY.P$30 60.35,45.72 61.57,44.5 61.57,24.18 62.99,22.76 62.99,7.52 63.8,6.71 63.8,6.1 64.21,5.69 64.21,5.49 CR_J10A.7
D5
  Top 0.254: STM32F4DISCOVERY.P$31 62.79,43.08 65.02,40.84 65.02,24.59 68.68,20.93 68.68,12.8 64.41,8.53 64.41,7.92 CR_J10A.8
D6  (via drill 0.61)
  Top 0.254: v76.2,41.66 76.2,25.4 69.9,19.1 69.9,8.33 66.85,5.28 CR_J10A.9
  Bottom 0.254: v76.2,41.66 76,41.45 64.21,41.45 64.21,44.3 62.79,45.72 STM32F4DISCOVERY.P$32
D7  (via drill 0.61)
  Top 0.254: v66.04,37.8 65.63,38.2 65.63,42.88 65.43,43.08 STM32F4DISCOVERY.P$33 | v66.04,31.09 69.29,27.84 69.29,10.97 66.85,8.53 66.85,7.92 CR_J10A.10
  Bottom 0.254: v66.04,37.8 65.02,36.78 65.02,31.09 v66.04,31.09
D8  (via drill 0.61)
  Top 0.254: STM32F4DISCOVERY.P$62 37.19,96.52 35.15,98.55 35.15,107.49 34.95,107.7 CR_J30.6 | v54.86,41.66 54.86,25.2 57.91,22.15 57.91,18.49 59.13,17.27 CR_J10B.3 | v53.85,49.58 53.65,49.78 v53.65,77.62
  Bottom 0.254: v54.86,41.66 54.05,42.47 54.05,49.58 v53.85,49.58 | v53.65,77.62 38.41,92.86 38.41,95.71 38.2,95.71 37.39,96.52 STM32F4DISCOVERY.P$62
D9  (via drill 0.61)
  Top 0.254: CR_J30.8 32.31,107.29 34.34,105.26 34.34,98.55 35.97,96.93 35.97,95.1 34.95,94.08 STM32F4DISCOVERY.P$59 | v59.33,32.51 59.33,19.91 CR_J10B.4 | v66.85,38.81 66.45,39.22 66.45,43.48 65.43,44.5 64.82,44.5 64.82,44.7 64.21,45.31 64.21,64.62 v54.66,74.17
  Bottom 0.254: v59.33,32.51 65.63,38.81 v66.85,38.81 | v54.66,74.17 34.95,93.88 STM32F4DISCOVERY.P$59
D10  (via drill 0.61)
  Top 0.254: 34.75,96.52 33.73,97.54 33.73,101.4 29.87,105.26 29.87,107.7 CR_J30.10 | 34.75,96.52 STM32F4DISCOVERY.P$60 34.75,96.52 | v29.67,65.84 33.73,69.9 33.73,95.5 34.75,96.52
  Bottom 0.254: v29.67,65.84 22.96,65.84 22.96,42.27 23.57,41.66 25.2,41.66 25.2,32.72 32.31,25.6 45.92,25.6 56.08,15.44 59.74,15.44 61.57,17.27 CR_J10B.5
D11  (via drill 0.61)
  Top 0.254: v42.06,29.06 42.06,39.22 41.25,40.03 41.25,92.86 42.27,93.88 STM32F4DISCOVERY.P$65 | v61.57,22.76 61.57,19.91 CR_J10B.6
  Bottom 0.254: v42.06,29.06 44.3,26.82 57.51,26.82 v61.57,22.76
D12  (via drill 0.61)
  Top 0.254: v40.23,47.55 40.23,93.67 40.03,93.88 STM32F4DISCOVERY.P$63 | v39.42,41.05 41.05,39.42 v41.05,28.25
  Bottom 0.254: v40.23,47.55 38.81,46.13 38.81,41.05 v39.42,41.05 | v41.05,28.25 43.08,26.21 47.35,26.21 54.86,18.69 62.79,18.69 64.21,17.27 CR_J10B.7
D13  (via drill 0.61)
  Top 0.254: v39.22,61.37 39.22,92.05 38.41,92.86 38.41,95.1 39.83,96.52 STM32F4DISCOVERY.P$64 | v62.59,41.05 64.41,39.22 64.41,19.91 CR_J10B.8
  Bottom 0.254: v39.22,61.37 46.33,54.25 50.6,54.25 58.73,46.13 58.73,41.05 v62.59,41.05
D14  (via drill 0.61)
  Top 0.254: v37.39,51.82 37.39,93.88 STM32F4DISCOVERY.P$61 | v50.8,41.05 51.61,40.23 v51.61,18.49
  Bottom 0.254: v37.39,51.82 41.25,47.95 41.25,41.05 v50.8,41.05 | v51.61,18.49 55.27,14.83 64.41,14.83 66.85,17.27 CR_J10B.9
D15  (via drill 0.61)
  Top 0.254: v56.9,29.06 56.9,41.45 55.27,43.08 STM32F4DISCOVERY.P$25 | v65.43,22.76 66.65,21.54 66.65,19.91 CR_J10B.10
  Bottom 0.254: v56.9,29.06 63.2,22.76 v65.43,22.76
DIN_RC2  (via drill 0.61)
  Top 0.254: v91.03,42.47 91.44,42.06 91.44,27.64 v92.86,26.21
  Bottom 0.254: v91.03,42.47 85.95,47.55 77.42,47.55 75.59,45.72 STM32F4DISCOVERY.P$42 | v92.86,26.21 94.28,24.79 95.3,24.79 95.5,24.59 95.91,24.59 CR_IC1.6
DINOUT_SC  (via drill 0.61)
  Top 0.254: v73.15,38.81 73.15,40.44 70.51,43.08 STM32F4DISCOVERY.P$37 | v87.78,30.07 91.85,26.01 91.85,23.57 95.91,19.51 CR_IC1.8
  Bottom 0.254: v73.15,38.81 79.05,38.81 v87.78,30.07
DOUT_RC1  (via drill 0.61)
  Top 0.254: v93.27,41.66 93.88,41.05 93.88,24.18 95.91,22.15 CR_IC1.7
  Bottom 0.254: v93.27,41.66 86.77,48.16 70.31,48.16 67.87,45.72 STM32F4DISCOVERY.P$36
DOUT_SO  (via drill 0.61)
  Top 0.254: v74.17,37.8 74.17,41.86 72.95,43.08 STM32F4DISCOVERY.P$39 | v89.2,25.4 94.28,20.32 94.28,18.69 95.91,17.07 CR_IC1.9
  Bottom 0.254: v74.17,37.8 78.23,33.73 80.87,33.73 v89.2,25.4
GND  (3 unrouted)
  pour Bottom: 0,140 120.09,140 120.09,0 0,0
  pour Top: 120.09,140 120.09,0 0,0 0,140
IIC0_SC
  Top 0.254: STM32F4DISCOVERY.P$34 65.43,45.72 68.48,48.77 68.48,62.18 77.62,71.32 77.62,71.73 CR_R8A.1
  Bottom 0.254: CR_J4A.8 111.96,93.67 106.68,88.39 106.68,71.53 78.44,71.53 78.23,71.73 77.83,71.73 CR_R8A.1
IIC0_SD
  Top 0.254: STM32F4DISCOVERY.P$35 67.87,43.28 69.29,44.7 69.29,49.78 77.62,58.12 77.62,68.07 CR_R7A.1
  Bottom 0.254: CR_J4A.6 111.96,91.03 107.29,86.36 107.29,69.09 79.05,69.09 78.03,68.07 77.83,68.07 CR_R7A.1
IIC1_SC  (via drill 0.61)
  Top 0.254: v70.71,85.14 76,79.86 76,77.62 77.62,76 77.62,75.79 CR_8B.1
  Bottom 0.254: STM32F4DISCOVERY.P$73 52.63,93.88 61.37,85.14 v70.71,85.14 76.81,91.24 99.77,91.24 102.21,93.67 CR_J4B.8
IIC1_SD  (via drill 0.61)
  Top 0.254: v100.58,87.78 100.58,89.41 102.21,91.03 CR_J4B.6
  Bottom 0.254: STM32F4DISCOVERY.P$70 47.55,96.52 48.97,95.1 48.97,93.27 60.76,81.48 75.18,81.48 77.01,83.31 77.62,83.31 CR_R7B.1 77.83,83.31 78.03,83.31 78.44,83.72 96.52,83.72 v100.58,87.78
J8/9-RC1
  Top 0.254: CR_R2.2 110.95,16.05 110.74,15.85 110.74,13.01 105.46,7.72 105.05,7.72 CR_J8/9.10
J8/9-RC2
  Bottom 0.254: CR_R1.2 113.59,12.19 106.68,5.28 105.05,5.28 CR_J8/9.9
J8/9-SC
  Top 0.254: CR_J8/9.7 102.62,5.28 102.62,7.72 CR_J8/9.8
  Bottom 0.254: CR_R3.2 108.71,13.61 102.82,7.72 102.62,7.72 CR_J8/9.8
J8/9-SO
  Top 0.254: CR_IC1.11 103.63,14.22 100.18,10.77 100.18,7.92 99.97,7.72 CR_J8/9.6
LCD_D7  (via drill 0.61)
  Top 0.254: CR_J15B.4 66.85,132.28 66.85,131.67 68.07,130.45 68.07,124.56 66.85,123.34 CR_J15A.4 66.85,123.14 69.49,120.5 69.49,110.34 70.71,109.12 CR_IC2.7 70.71,108.92 70.71,108.71 v68.07,106.07 | v60.55,103.23 59.13,101.8 59.13,95.5 57.71,94.08 STM32F4DISCOVERY.P$77
  Bottom 0.254: v60.55,103.23 63.4,106.07 v68.07,106.07
LCD_E1  (via drill 0.61)
  Top 0.254: v79.05,106.88 79.05,95.5 80.47,94.08 STM32F4DISCOVERY.P$95 | v55.27,118.67 55.27,121.92 56.49,123.14 CR_J15A.12
  Bottom 0.254: v79.05,106.88 75.18,110.74 74.57,110.74 73.15,112.17 54.46,112.17 52.22,114.4 CR_R33.6 52.02,114.61 51.82,114.61 51.82,115.21 v55.27,118.67
LCD_E2  (via drill 0.61)
  Top 0.254: v80.26,104.24 80.26,96.72 80.47,96.52 STM32F4DISCOVERY.P$96 | 44.5,114.61 v47.95,111.15 | 44.5,114.61 CR_R33.3 44.5,114.61 | 44.5,114.61 v44.5,126.8
  Bottom 0.254: v80.26,104.24 73.36,111.15 v47.95,111.15 | CR_J30.7 32.31,110.34 34.95,112.98 42.88,112.98 44.3,114.4 CR_R33.3 | v44.5,126.8 48.77,131.06 55.27,131.06 56.49,132.28 CR_J15B.12
LCD_RS  (via drill 0.61)
  Top 0.254: v75.39,111.76 76.81,110.34 76.81,95.1 77.83,94.08 STM32F4DISCOVERY.P$93 | CR_J15B.14 54.25,132.28 54.86,131.67 54.86,126.59 55.47,125.98 55.47,124.56 54.25,123.34 CR_J15A.14 | v60.55,120.09 60.55,116.64 CR_IC2.14
  Bottom 0.254: v75.39,111.76 74.37,112.78 64.62,112.78 60.96,116.43 60.76,116.43 CR_IC2.14 | 54.25,120.09 54.25,123.14 CR_J15A.14 | 54.25,120.09 54.25,119.28 49.58,114.61 CR_R33.5 49.38,114.4 47.35,112.37 36.98,112.37 34.95,110.34 CR_J30.5 | 54.25,120.09 v60.55,120.09
LCD_RW  (via drill 0.61)
  Top 0.254: STM32F4DISCOVERY.P$88 70.31,96.52 64.62,102.21 64.62,111.96 63.8,112.78 63.8,116.03 63.4,116.43 CR_IC2.13 63.2,116.64 61.98,117.86 v61.98,120.09 | CR_J15A.11 56.49,125.78 55.47,126.8 55.47,133.71 56.49,134.72 CR_J15B.11
  Bottom 0.254: 40.03,116.43 38,116.43 35.15,113.59 34.75,113.59 33.33,112.17 31.5,112.17 29.67,110.34 CR_J30.9 | 40.03,116.43 45.11,116.43 46.94,114.61 CR_R33.4 | 40.03,116.43 50.6,127 55.27,127 56.49,125.78 CR_J15A.11 56.49,125.58 57.51,124.56 57.91,124.56 57.91,122.73 58.73,121.92 60.15,121.92 v61.98,120.09
LCD_SER_RCLK  (via drill 0.61)
  Top 0.254: v61.77,114 61.77,108.51 61.57,108.31 61.57,95.1 62.59,94.08 STM32F4DISCOVERY.P$81
  Bottom 0.254: v61.77,114 59.54,116.23 59.54,117.65 64.41,117.65 65.43,116.64 65.63,116.64 CR_IC2.12
LCD_SER_SCLK  (via drill 0.61)
  Top 0.254: v71.53,97.94 71.93,98.35 71.93,112.98 v71.12,113.79
  Bottom 0.254: v71.53,97.94 71.12,98.35 62.18,98.35 60.35,96.52 STM32F4DISCOVERY.P$80 | v71.12,113.79 68.48,116.43 CR_IC2.11
LCD_VOLTAGE_OPTION  (via drill 0.61)
  Top 1.016: CR_J30.4 37.39,109.93 CR_J30.3 37.39,110.34 37.39,112.57 39.22,114.4 CR_R33.1 39.22,115.01 v39.22,124.77 | CR_IC2.16 55.47,116.64 51.61,120.5 51.61,123.14 CR_J15A.16 51.21,123.34 49.58,124.97 49.58,126.59 49.99,127 49.99,130.86 51.41,132.28 CR_J15B.16
  Bottom 1.016: CR_J15_S.2 93.47,107.49 92.25,107.49 87.78,111.96 78.23,111.96 C3.1 77.62,111.96 77.01,111.96 75.18,113.79 73.56,113.79 70.92,116.43 CR_IC2.10 70.71,117.04 69.09,118.67 57.3,118.67 55.68,117.04 55.68,116.64 CR_IC2.16 | CR_J15B.16 51.41,132.49 46.33,132.49 44.91,131.06 CR_P2.A 45.11,130.66 v39.22,124.77
M1_R4
  Bottom 0.254: M1_IC1.7 29.06,122.94 30.28,124.16 31.9,124.16 32.11,123.95 M1_R4.1
M1_RX+
  Bottom 0.254: 16.26,105.87 16.05,105.66 16.05,95.3 14.22,95.3 14.02,95.1 MIDI1_IN.4 | 16.26,105.87 19.3,108.92 M1_R3.2 | 16.26,105.87 12.39,109.73 5.49,109.73 5.49,113.59 7.32,115.42 M1_J1.5
M1_RX+D1
  Top 0.254: M1_D1.C 19.3,99.16 18.9,99.57 18.9,100.79 19.3,101.19 M1_R3.1 19.3,101.4 19.3,102.01 18.09,103.23 18.09,119.69 M1_IC1.2
M1_RX-
  Top 0.254: M1_D1.A 16.66,94.08 16.66,100.99 13.82,103.83 13.82,105.05 MIDI1_IN.5 14.02,105.26 14.22,105.46 14.22,113.79 12.6,115.42 M1_J1.1
  Bottom 0.254: M1_IC1.3 21.34,120.29 16.46,115.42 12.6,115.42 M1_J1.1
M1_TX+  (via drill 0.61)
  Top 0.254: 23.98,100.18 21.74,97.94 21.74,86.56 21.34,86.16 21.34,83.52 14.02,76.2 14.02,75.39 MIDI1_OUT.4 | 23.98,100.18 M1_R2.1 23.98,100.18 | v20.12,110.74 23.98,106.88 23.98,100.18
  Bottom 0.254: v20.12,110.74 9.75,110.74 7.52,112.98 M1_J1.6
M1_TX-
  Top 0.254: M1_J1.2 12.39,112.98 9.14,109.73 9.14,105.46 16.05,98.55 16.05,87.78 14.02,85.75 14.02,85.34 MIDI1_OUT.5
  Bottom 0.254: M1_R1.1 19.51,85.34 19.3,85.14 14.02,85.14 MIDI1_OUT.5
M2_R4
  Bottom 0.254: M2_IC1.7 31.09,34.14 31.9,34.95 34.75,34.95 M2_R4.1
M2_RX+  (via drill 0.61)
  Top 0.254: v9.14,34.14 9.14,30.07 7.11,28.04 M2_J1.5
  Bottom 0.254: 21.54,45.72 20.12,47.14 19.1,47.14 14.22,52.02 14.22,55.27 14.02,55.27 MIDI2_IN.4 | 21.54,45.72 M2_R3.2 21.54,45.72 | v9.14,34.14 20.73,45.72 21.54,45.72
M2_RX+D1
  Top 0.254: 21.54,37.8 19.91,36.17 M2_D1.C | 21.54,37.8 21.54,38 M2_R3.1 21.54,37.8 | 21.54,37.8 21.54,35.97 23.37,34.14 M2_IC1.2
M2_RX-
  Bottom 0.254: M2_IC1.3 22.96,31.5 19.91,28.45 M2_D1.A 19.71,28.45 12.6,28.45 12.39,28.25 | 12.39,28.25 12.19,28.04 M2_J1.1 12.39,28.25 | 12.39,28.25 12.19,28.25 10.57,29.87 8.13,29.87 8.13,59.74 13.82,65.43 MIDI2_IN.5
M2_TX+
  Top 0.254: 14.02,36.17 14.02,35.97 MIDI2_OUT.4 14.02,36.17 | 14.02,36.17 14.02,36.78 14.22,36.98 14.22,42.88 19.51,48.16 M2_R2.1 | M2_J1.6 5.28,27.23 5.28,32.31 9.14,36.17 14.02,36.17
M2_TX-  (via drill 0.61)
  Top 0.254: M2_R1.1 23.37,85.55 21.95,84.12 21.95,82.7 16.05,76.81 16.05,49.38 13.82,47.14 13.82,45.92 MIDI2_OUT.5 | M2_J1.2 16.26,29.46 v16.26,43.28
  Bottom 0.254: v16.26,43.28 13.82,45.72 MIDI2_OUT.5
MI1
  Top 0.254: STM32F4DISCOVERY.P$13 39.83,43.28 38.41,44.7 38.41,46.13 28.25,56.29 28.25,110.95 27.43,111.76 27.43,118.47 28.85,119.89 28.85,120.29 M1_IC1.6 28.85,120.5 27.23,122.12 27.23,126.19 29.67,128.63 29.67,131.88 30.07,132.28 CR_J11E.4
  Bottom 0.254: M1_R5.2 34.75,122.33 33.12,120.7 29.67,120.7 29.46,120.5 29.06,120.5 M1_IC1.6
MI2  (via drill 0.61)
  Top 0.254: v75.18,33.33 75.18,42.88 75.39,43.08 STM32F4DISCOVERY.P$41 | v27.43,34.95 23.16,39.22 23.16,46.53 25.2,48.56 25.2,86.36 23.16,88.39 23.16,97.74 25.6,100.18 25.6,125.37 29.06,128.83 29.06,133.71 30.07,134.72 CR_J11E.3
  Bottom 0.254: v75.18,33.33 71.93,30.07 37.59,30.07 | 37.59,30.07 M2_R5.2 37.59,30.07 | 37.59,30.07 32.51,30.07 31.09,31.5 M2_IC1.6 30.89,31.5 v27.43,34.95
MI3  (via drill 0.61)
  Top 0.254: v34.54,131.47 40.44,125.58 40.44,113.59 41.45,112.57 41.45,100.38 48.56,100.38 52.43,96.52 STM32F4DISCOVERY.P$74
  Bottom 0.254: v34.54,131.47 34.14,131.06 28.85,131.06 27.64,132.28 CR_J11E.6
MI4  (via drill 0.61)
  Top 0.254: v62.59,101.19 62.59,99.16 65.23,96.52 STM32F4DISCOVERY.P$84 | v47.14,110.13 43.28,114 43.28,125.58 34.34,134.52 34.34,135.53 33.12,136.75 27.84,136.75 27.84,134.93 CR_J11E.5
  Bottom 0.254: v62.59,101.19 61.57,102.21 59.74,102.21 51.82,110.13 v47.14,110.13
MO1  (via drill 0.61)
  Top 0.254: v38.81,58.52 38.81,46.74 39.83,45.72 STM32F4DISCOVERY.P$14 | v17.68,81.28 17.68,85.95 21.13,89.41 21.13,92.05 17.48,95.71 17.48,124.77 24.99,132.28 CR_J11E.8
  Bottom 0.254: v38.81,58.52 19.71,77.62 M1_R1.2 19.51,77.83 19.3,77.83 19.3,79.65 v17.68,81.28
MO2  (via drill 0.61)
  Top 0.254: v70.92,49.17 70.92,47.55 72.75,45.72 STM32F4DISCOVERY.P$40
  Bottom 0.254: v70.92,49.17 63.8,56.29 45.72,56.29 23.98,78.03 23.37,78.03 | 23.37,78.03 M2_R1.2 23.37,78.03 | 23.37,78.03 23.16,78.23 21.54,78.23 21.54,100.18 22.96,101.6 23.16,101.6 23.16,126.19 22.15,127.2 20.12,127.2 20.12,134.93 21.95,136.75 23.16,136.75 24.99,134.93 CR_J11E.7
MO3  (via drill 0.61)
  Top 0.254: v71.93,136.14 71.93,132.28 75.79,128.42 75.79,124.77 84.12,116.43 84.12,95.1 83.11,94.08 STM32F4DISCOVERY.P$97
  Bottom 0.254: v71.93,136.14 71.32,136.75 48.36,136.75 44.5,132.89 42.27,132.89 39.83,130.45 24.38,130.45 22.55,132.28 CR_J11E.10
MO4  (via drill 0.61)
  Top 0.254: v63.6,99.97 63.6,99.77 66.45,96.93 66.45,95.3 67.67,94.08 STM32F4DISCOVERY.P$85
  Bottom 0.254: v63.6,99.97 63.4,100.18 35.56,100.18 23.77,111.96 23.77,130.25 22.15,130.25 20.73,131.67 20.73,134.72 22.55,134.72 CR_J11E.9
N$1  (via drill 0.61)
  Top 0.254: v64.62,121.11 64.62,116.23 64.82,116.03 64.82,112.57 68.28,109.12 CR_IC2.6 | CR_J15B.3 66.65,134.72 65.63,133.71 65.63,131.88 66.65,130.86 66.65,125.78 CR_J15A.3
  Bottom 0.254: v64.62,121.11 64.62,121.92 65.63,122.94 65.63,124.77 65.84,124.77 66.65,125.58 CR_J15A.3
N$2
  Top 0.254: CR_IC2.5 65.84,108.92 67.67,107.09 68.28,107.09 69.49,108.31 69.49,109.32 67.87,110.95 67.87,114.4 67.06,115.21 67.06,120.09 64.41,122.73 64.41,123.14 CR_J15A.6 64.41,123.34 65.63,124.56 65.63,131.06 64.41,132.28 CR_J15B.6
N$3  (via drill 0.61)
  Top 0.254: v73.76,107.09 74.78,108.1 74.78,110.95 74.37,111.35 74.37,115.01 75.18,115.82 75.18,128.22 71.12,132.28 71.12,134.72 69.09,136.75 64.41,136.75 64.41,134.93 CR_J15B.5 64.21,134.72 64.21,134.52 63.8,134.11 63.8,133.5 62.99,132.69 62.99,131.06 63.6,130.45 63.6,126.39 64.21,125.78 CR_J15A.5
  Bottom 0.254: v73.76,107.09 65.23,107.09 63.4,108.92 CR_IC2.4
N$4
  Top 0.254: CR_IC2.3 60.55,109.12 59.54,110.13 59.54,120.5 61.57,122.53 61.57,123.14 CR_J15A.8 61.77,123.34 61.77,123.55 62.18,123.95 62.18,124.56 62.99,125.37 62.99,130.25 62.38,130.86 62.38,131.67 61.77,132.28 CR_J15B.8
N$8
  Top 0.254: CR_IC2.2 58.12,108.92 56.29,107.09 54.25,107.09 54.25,107.7 53.24,108.71 53.24,116.64 47.55,122.33 47.55,131.67 49.99,134.11 49.99,135.53 51.21,136.75 61.57,136.75 61.57,134.93 CR_J15B.7 61.57,134.72 60.55,133.71 60.55,131.88 61.16,131.27 61.16,126.19 61.57,125.78 CR_J15A.7
N$9  (via drill 0.61)
  Top 0.254: v48.56,129.44 48.56,122.12 53.85,116.84 53.85,110.74 55.47,109.12 CR_IC2.1 | CR_J15A.10 59.33,123.34 60.55,124.56 60.55,130.45 59.33,131.67 59.33,132.28 CR_J15B.10
  Bottom 0.254: v48.56,129.44 49.58,130.45 57.51,130.45 59.33,132.28 CR_J15B.10
N$10
  Top 0.254: CR_IC2.15 58.12,116.64 57.91,116.84 57.91,123.55 58.73,124.36 58.73,124.97 59.13,125.37 59.13,125.58 CR_J15A.9 59.13,125.78 59.13,126.39 57.91,127.61 57.91,133.5 59.13,134.72 CR_J15B.9
N$12  (via drill 0.61)
  Top 0.254: CR_J15A.13 54.05,125.78 52.83,127 52.83,133.71 54.05,134.93 CR_J15B.13 | v48.77,134.31 48.77,133.71 39.62,133.71 CR_P2.S
  Bottom 0.254: v48.77,134.31 50.6,136.14 52.63,136.14 53.85,134.93 54.05,134.93 CR_J15B.13
N$14
  Bottom 0.254: CR_R13.2 90.02,128.42 87.38,125.78 85.75,125.78 CR_P1.S
N$15
  Top 0.254: CR_R13.1 90.22,120.9 95.5,120.9 CR_T1.2
N$18
  Top 0.254: CR_J15A.2 69.49,123.34 71.12,124.97 71.12,130.05 69.49,131.67 69.49,132.28 CR_J15B.2
  Bottom 0.254: CR_T1.3 96.72,122.94 92.05,127.61 92.05,130.25 78.03,130.25 77.22,129.44 76.81,129.44 CR_R12.1 76.61,129.44 72.34,129.44 69.49,132.28 CR_J15B.2
RC-I-
  Bottom 0.254: CR_IC1.14 103.83,22.15 105.66,23.98 110.95,23.98 CR_R2.1
RC-O-
  Top 0.254: CR_IC1.13 103.83,19.3 113.59,19.3 113.59,19.71 CR_R1.1
SC-
  Bottom 0.254: CR_IC1.12 103.83,17.07 107.9,21.13 108.71,21.13 CR_R3.1
SPI_RC1  (via drill 0.61)
  Top 0.254: v72.54,6.1 73.76,6.1 CR_SDCARD.2 | v63.2,57.51 52.63,46.94 52.63,45.72 STM32F4DISCOVERY.P$24 | v92.86,27.64 92.05,28.45 v92.05,51.21
  Bottom 0.254: v72.54,6.1 86.36,19.91 88.19,19.91 89.41,21.13 89.41,24.18 | 89.41,24.18 87.99,24.18 87.78,24.38 CR_J16.10 | v63.2,57.51 82.5,57.51 U$2.1 82.7,57.51 85.75,57.51 v92.05,51.21 | v92.86,27.64 89.41,24.18
SPI_RC2  (via drill 0.61)
  Top 0.254: v78.03,32.72 78.03,43.08 STM32F4DISCOVERY.P$43
  Bottom 0.254: v78.03,32.72 81.28,29.46 81.69,29.46 86.36,24.79 86.36,22.55 86.97,22.55 87.58,21.95 CR_J16.9
SPI_SC  (via drill 0.61)
  Top 0.254: CR_SDCARD.5 88.39,4.67 90.02,4.67 90.02,16.26 85.14,21.13 85.14,21.74 CR_J16.7 84.94,21.95 84.94,24.38 CR_J16.8 85.14,24.38 85.14,24.99 v88.19,28.04 | v88.8,30.89 v88.8,62.99 | v52.63,58.93 v46.13,52.43
  Bottom 0.254: v88.8,62.99 84.53,67.26 82.91,67.26 82.7,67.46 U$2.5 82.5,67.46 81.08,67.46 79.86,66.24 77.42,66.24 73.15,70.51 72.95,70.51 70.51,72.95 69.7,72.95 69.49,73.15 66.85,73.15 v52.63,58.93 | v88.8,30.89 88.8,28.04 v88.19,28.04 | v46.13,52.43 43.89,52.43 43.89,44.7 42.47,43.28 STM32F4DISCOVERY.P$15
SPI_SI  (via drill 0.61)
  Top 0.254: CR_SDCARD.7 88.19,6.1 86.36,6.1 86.36,17.88 82.7,21.54 82.7,21.74 CR_J16.5 | v49.58,57.3 45.11,52.83 45.11,45.72 STM32F4DISCOVERY.P$18 | v81.28,28.45 79.45,30.28 v79.45,72.54
  Bottom 0.254: 79.45,72.75 82.3,72.75 82.5,72.54 U$2.7 | 79.45,72.75 78.44,73.76 66.04,73.76 v49.58,57.3 | v81.28,28.45 81.28,23.16 82.5,21.95 CR_J16.5 | 79.45,72.75 v79.45,72.54
SPI_SO  (via drill 0.61)
  Top 0.254: CR_SDCARD.3 73.97,5.28 74.98,5.28 81.28,11.58 81.28,23.16 82.5,24.38 CR_J16.6 | v52.63,57.3 46.33,51 46.33,44.5 45.11,43.28 STM32F4DISCOVERY.P$17 | v82.5,27.23 84.12,28.85 84.12,53.65 81.08,56.69 v81.08,59.54
  Bottom 0.254: 81.08,59.74 55.07,59.74 v52.63,57.3 | 81.08,59.74 82.3,59.74 82.5,59.94 U$2.2 | v82.5,27.23 82.7,27.23 82.7,24.38 CR_J16.6 | 81.08,59.74 v81.08,59.54

### Text on the board
tNames: SPI or uSD | A0 | A1 | A2 | A3 | 3V3 | 5V | GND | 12V | 5V | GND | 12V | 5V | MO2 | MI2 | GND | D6 | D4 | D2 | A5 | D0 | 3V3 | 5V | A4 | GND
bNames: RC1 | SC | RC2 | 3V3 | SC | SO | 3V3 | SI | GND | 3V3 | GND | WS | MCLK | SC | SDA | SC | 3V3 | GND | 3V3 | GND | A0 | A1 | A2 | GND | A3 | 3V3 | 3V3 | 12V | 5V | GND | 5V | GND | 12V | CR_IC1 | RC1 | CR_IC4 / M1 | CR_IC5 / M2 | CR_IC8 / M3 | CR_IC9 / M4 | SC | RC2 | SC | SO | SI | 5V | 5V | GND | GND | 5V | MO2 | MO1 | MI2 | MI1 | GND | GND | GND | GND | GND | 5V | SO | SC | RC1 | D7 | D6 | GND | 5V | SI | SC | RC2 | D5 | D4 | D3 | D2 | A5 | D1 | D0 | 3V3 | 5V | A4 | 3V3 | GND | D7 | D5 | D3 | D1 | E | RS | LCD-VD | Lum | GND | LCD-VD | SDA | SC | RC | D6 | D4 | D2 | D0 | RW | V0 | GND | 5V | DC | D0 | D1 | D7 | D5 | D3 | D1 | E | RS | LCD-VD | Lum | D6 | D4 | D2 | D0 | RW | V0 | GND | 5V